# Altium schematic sheet JacdacTBlockButton 62.SchDoc: Complete design
size A4; DocumentNumber: 1; SheetNumber: 1; SheetTotal: 1; VersionControl_RevNumber: 1
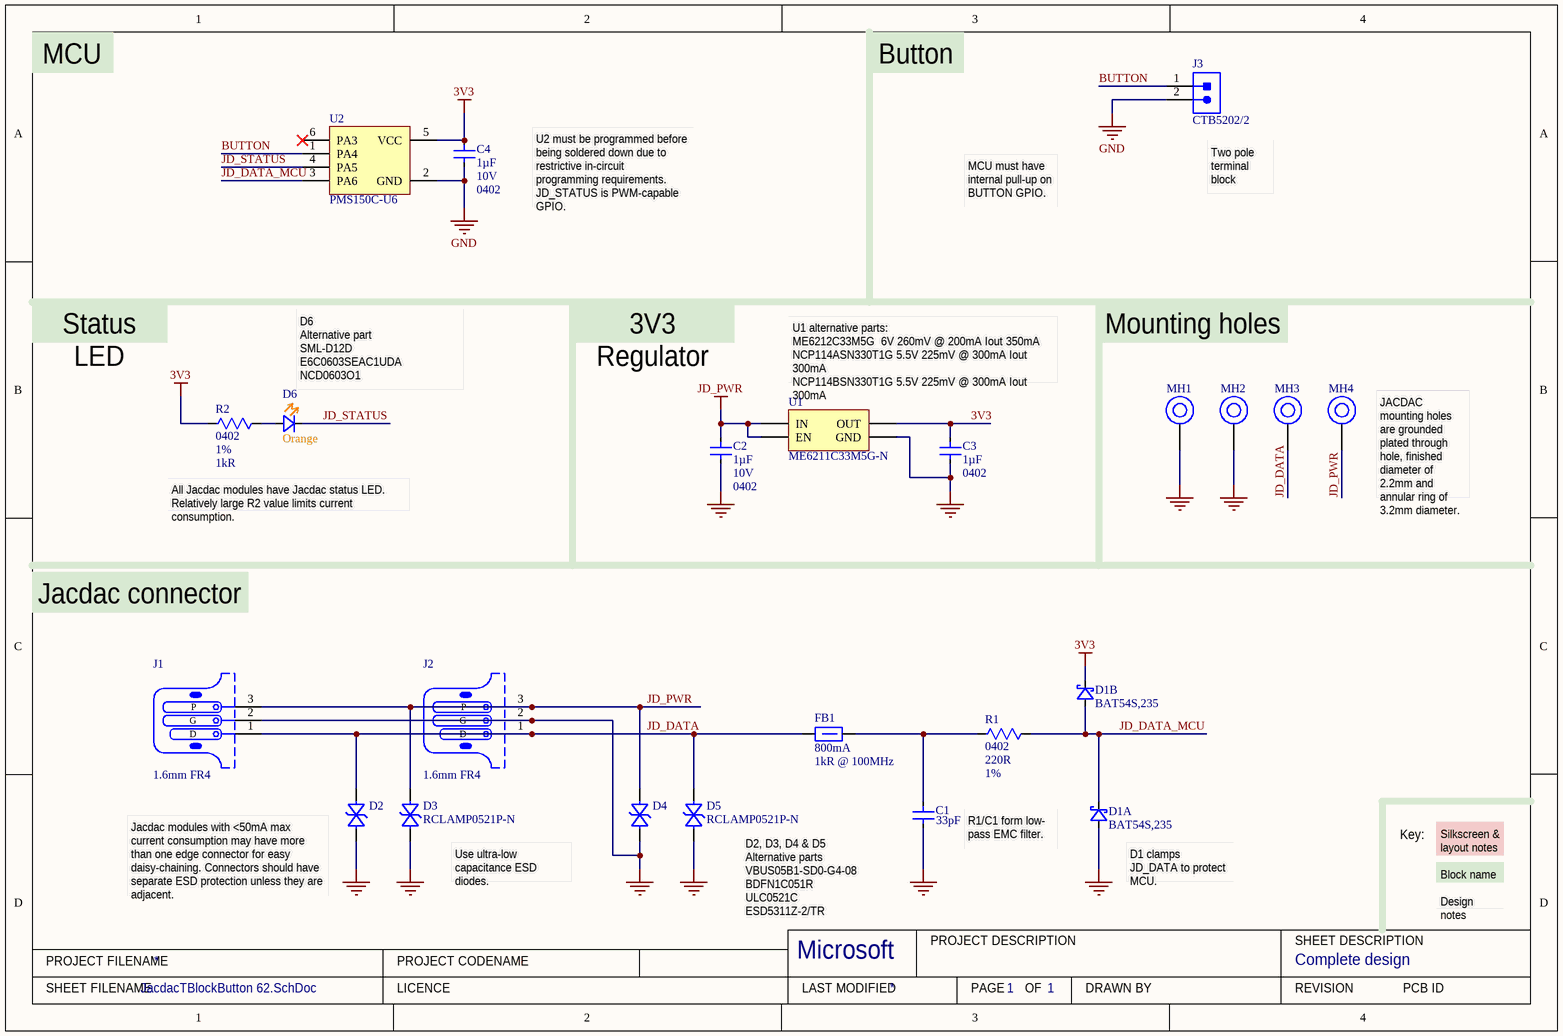
[diagram p0: JacdacTBlockButton 62.SchDoc]

## Parts
C1  Capacitance: 33pF  [C0402_0.55MM - without outline]  (hidden comment: CL05C330JB5NNNC)
C2  Capacitance: 1µF  Voltage Rating: 10V  Case Code (Imperial): 0402  [C0402_0.55MM - without outline]  (hidden comment: CL05A105KP5NNNC)
C3  Capacitance: 1µF  Case Code (Imperial): 0402  [C0402_0.55MM - without outline]  (hidden comment: CL05A105KP5NNNC)
C4  Capacitance: 1µF  Voltage Rating: 10V  Case Code (Imperial): 0402  [C0402_0.55MM - without outline]  (hidden comment: CL05A105KP5NNNC)
D1  Manufacturer Part Number: BAT54S,235  [NXP-BAT54S-TO-236AB - without outline]  (hidden comment: BAT54S)  (parts A,B of 2)
D2  RCLAMP0521P-N  [TVS 0402 - L]  (value not drawn)
D3  RCLAMP0521P-N  [TVS 0402 - L]
D4  RCLAMP0521P-N  [TVS 0402 - L]  (value not drawn)
D5  RCLAMP0521P-N  [TVS 0402 - L]
D6  Colour: Orange  [0603 Orange - without outline]  (hidden comment: 19-217/S2C-AQ1R1B/3T)
FB1  Current Rating: 800mA  Impedance: 1kR @ 100MHz  [TDK MPZ1608 0.8mm - without outline]  (hidden comment: TDK MPZ1608S102ATA00)
J1  PCB Type: 1.6mm FR4  [JACDAC_EDGE_CONNECTOR_NO_TRACES]  (hidden comment: 3 pin JACDAC edge connector)  (no BOM)
J2  PCB Type: 1.6mm FR4  [JACDAC_EDGE_CONNECTOR_NO_TRACES]  (hidden comment: 3 pin JACDAC edge connector)  (no BOM)
J3  TERMINAL BLOCK, WIRE TO BRD, 2POS  [CTB5202-2]  (value not drawn)
MH1  MH_5.0MMK_3.0MMC_2.1MMD_PTH  [MH_5.0MMK_3.0MMC_2.1MMD_PTH]  (value not drawn)  (no BOM)
MH2  MH_5.0MMK_3.0MMC_2.1MMD_PTH  [MH_5.0MMK_3.0MMC_2.1MMD_PTH]  (value not drawn)  (no BOM)
MH3  MH_5.0MMK_3.0MMC_2.1MMD_PTH  [MH_5.0MMK_3.0MMC_2.1MMD_PTH]  (value not drawn)  (no BOM)
MH4  MH_5.0MMK_3.0MMC_2.1MMD_PTH  [MH_5.0MMK_3.0MMC_2.1MMD_PTH]  (value not drawn)  (no BOM)
R1  Case Code (Imperial): 0402  Resistance: 220R  Tolerance: 1%  [R0402 - Without outline]  (hidden comment: RC0402FR-07220RL)
R2  Case Code (Imperial): 0402  Tolerance: 1%  Resistance: 1kR  [R0402 - Without outline]  (hidden comment: RC0402FR-071KL)
U1  ME6211C33M5G-N  [MICRONE-SOT23-5]
U2  Manufacturer Part Number: PMS150C-U6  [SOT23-6]  (hidden comment: PMS150C)

## Nets
3V3: C3.2 C4.2 D1.2(K) R2.2 U1.5(OUT) U2.5(VCC)
GND: C1.1 C2.1 C3.1 C4.1 D1.1(A) D2.2(A) D3.2(A) D4.2(A) D5.2(A) J1.2(G) J2.2(G) J3.2 MH1.1 MH2.1 U1.2(GND) U2.2(GND)
JD_PWR: C2.2 D3.1(K) D4.1(K) J1.3(P) J2.3(P) MH4.1 U1.1(IN) U1.3(EN)
BUTTON: J3.1 U2.1(PA4)
JD_DATA: D2.1(K) D5.1(K) FB1.1 J1.1(D) J2.1(D) MH3.1
JD_DATA_MCU: D1.3(K) R1.1 U2.3(PA6)
JD_STATUS: D6.1(K) U2.4(PA5)
NetC1_2: C1.2 FB1.2 R1.2
NetD6_2: D6.2(A) R2.1

Not connected (* = marked no-connect by the designer): U2 6(PA3)*

## Notes on the sheet
- MCU
- Button
- U2 must be programmed before being soldered down due to restrictive in-circuit programming requirements. JD_STATUS is PWM-capable GPIO.
- MCU must have internal pull-up on BUTTON GPIO.
- (near J3) Two pole terminal block
- Status LED
- (near D6) D6
  Alternative part
  SML-D12D
  E6C0603SEAC1UDA
  NCD0603O1
- 3V3 Regulator
- U1 alternative parts:
  ME6212C33M5G  6V 260mV @ 200mA Iout 350mA
  NCP114ASN330T1G 5.5V 225mV @ 300mA Iout 300mA
  NCP114BSN330T1G 5.5V 225mV @ 300mA Iout 300mA
- Mounting holes
- All Jacdac modules have Jacdac status LED. Relatively large R2 value limits current consumption.
- (near MH4) JACDAC mounting holes are grounded plated through hole, finished diameter of 2.2mm and annular ring of 3.2mm diameter.
- Jacdac connector
- R1/C1 form low-
  pass EMC filter.
- Key:
- Silkscreen & layout notes
- (near D2) Jacdac modules with <50mA max current consumption may have more than one edge connector for easy daisy-chaining. Connectors should have separate ESD protection unless they are adjacent.
- (near D3) Use ultra-low capacitance ESD diodes.
- (near C1) D2, D3, D4 & D5
  Alternative parts
  VBUS05B1-SD0-G4-08
  BDFN1C051R
  ULC0521C
  ESD5311Z-2/TR
- (near D1) D1 clamps JD_DATA to protect MCU.
- Block name
- Design notes
- PROJECT FILENAME
- PROJECT CODENAME
- Microsoft
- PROJECT DESCRIPTION
- SHEET DESCRIPTION
- SHEET FILENAME
- LICENCE
- LAST MODIFIED
- PAGE
- OF
- DRAWN BY
- REVISION
- PCB ID

## Library data of the parts
C1 = CL05C330JB5NNNC: CAP CER 33PF 50V C0G/NP0 0402; Manufacturer: Samsung; Material: Ceramic; Tolerance: 5%; Dielectric: C0G; Temperature Coefficient: 300ppm/°C; Supplier 1: Digi-Key; Manufacturer Part Number: CL05C330JB5NNNC; RoHS: Yes; Category: Ceramic Capacitors; Stock 1: 5436088; Pricing 1: 1=0.10000, 10=0.02300, 50=0.01260, 100=0.01040, 500=0.00740, 1000=0.00582, 2500=0.00529, 5000=0.00487 (USD); Mount: Surface Mount; Case Code (Metric): 1005; Case Code (Imperial): 0402; Contact Plating: Tin; Min Operating Temperature: -55°C; Max Operating Temperature: 125°C; Package Quantity: 1; Packaging: Tape and Reel; Voltage: 50V; Voltage Rating (DC): 50V; Series: CL; Construction: Flat; Length: 1mm; Width: 0.02inch; Height: 0.5mm; Thickness: 0.022inch; Depth: 0.5mm; Radiation Hardening: No; Lead Free: Lead Free; RoHS Compliant: Yes; ComponentLink1URL: https://datasheet.ciiva.com/15195/getdatasheetpartid-355282-15195687.pdf; ComponentLink1Description: Online datasheet; Supplier 2: Newark; Stock 2: 45340; Pricing 2: 1=0.12500, 25=0.02900, 100=0.01300, 250=0.01100, 500=0.00900, 1000=0.00600 (USD); Supplier 3: Mouser; Stock 3: 8877; Pricing 3: 1=0.10000, 10=0.01400, 50=0.01400, 100=0.01100, 1000=0.00600, 10000=0.00400 (USD); Supplier 4: Farnell; Stock 4: 10934; Pricing 4: 150=0.01120, 500=0.00860, 2500=0.00640, 5000=0.00550 (GBP); Supplier Part Number 4: 3013373RL; Supplier Part Number 3: 187-CL05C330JB5NNNC; Supplier Part Number 2: 82AC9259; Supplier Part Number 1: 1276-1272-1-ND; Voltage Rating: 50V; Case/Package: 0402
C2-C4 = CL05A105KP5NNNC: CAP CER 1UF 10V X5R 0402; Manufacturer: Samsung; Material: Ceramic; Tolerance: 10%; Supplier 1: Digi-Key; Manufacturer Part Number: CL05A105KP5NNNC; RoHS: Yes; Category: Capacitors; Stock 1: 5705569; Pricing 1: 1=0.10000, 10=0.03900, 50=0.02100, 100=0.01720, 500=0.01228, 1000=0.00965, 2500=0.00877, 5000=0.00807 (USD); Mount: Surface Mount; Case/Package: 0402; Case Code (Metric): 1005; Contact Plating: Tin; Min Operating Temperature: -55°C; Max Operating Temperature: 85°C; Dielectric: X5R; Package Quantity: 1; Packaging: Tape and Reel; Length: 1mm; Height: 0.5mm; Width: 0.02inch; Thickness: 0.022inch; Depth: 0.5mm; Radiation Hardening: No; ComponentLink1URL: https://datasheet.ciiva.com/15195/getdatasheetpartid-358390-15195630.pdf; ComponentLink1Description: Online datasheet; Supplier 2: Mouser; Stock 2: 928941; Pricing 2: 1=0.10000, 10=0.04200, 100=0.01800, 500=0.01300, 1000=0.01000, 2500=0.00900 (USD); Supplier 3: Farnell; Stock 3: 53670; Pricing 3: 10=0.02450, 100=0.02000, 500=0.01310, 2500=0.00920, 5000=0.00810, 10000=0.00640, 50000=0.00490 (GBP); Supplier Part Number 3: 3013329; Supplier Part Number 2: 187-CL05A105KP5NNNC; Supplier Part Number 1: 1276-1076-1-ND; Created: DG; Checked: ?
  C3: Voltage Rating: 10V
D1 = BAT54S: DIODE ARRAY SCHOTTKY 30V SOT23; Manufacturer: Nexperia; Supplier 1: Digi-Key; RoHS: No; Category: Rectifier Diodes; Stock 1: 14011; Pricing 1: 1=0.13000, 10=0.11900, 100=0.05610, 500=0.03326, 1000=0.02185, 5000=0.02138 (USD); ComponentLink1URL: https://assets.nexperia.com/documents/data-sheet/BAT54_SER.pdf; ComponentLink1Description: NXP datasheet online; Supplier 2: Mouser; Supplier 3: RSComponents; Supplier Part Number 2: 771-BAT54S235; Supplier Part Number 3: 1707990; Supplier Part Number 1: 1727-1868-1-ND
D2-D5 = RCLAMP0521P-N: Bidirectional 5V (Max) 6V 16V 3.5A (8/20us) 0402 TVS RoHS; Manufacturer: Born Semiconductor; Package: 0402; Created By: D Gakure; Checked By: ?; Supplier1: LCSC; Supplier1 Part Number: C316043; ComponentLink1Description: Online datasheet; ComponentLink1URL: https://datasheet.lcsc.com/szlcsc/Bourne-Semicon-Shenzhen-RCLAMP0521P-N_C316043.pdf; Manufacturer Part Number: RCLAMP0521P-N
D6 = 19-217/S2C-AQ1R1B/3T: LED ORANGE DIFFUSED 1608 SMD; Manufacturer: Everlight Elec; Lens Color: White; Luminous Intensity: 100mcd; Test Current: 25mA; Dominant Wavelength: 605nm; Forward Voltage: 2.05V; Manufacturer Part Number: 19-217/S2C-AQ1R1B/3T; RoHS: Yes; Category: LEDs; Mount: Surface Mount; Case/Package: 0603; Color: Orange; Case Code (Metric): 1608; Case Code (Imperial): 0603; Lens Transparency: Diffused; Length: 1.6mm; Width: 0.8mm; Height: 0.65mm; Lead Free: Lead Free; ComponentLink1URL: https://datasheet.lcsc.com/lcsc/1912171731_Everlight-Elec-19-217-S2C-AQ1R1B-3T_C146215.pdf; ComponentLink1Description: Online datasheet; Supplier 1: LCSC; Supplier 1 Part Number: C146215
FB1 = TDK MPZ1608S102ATA00: 0603 1k@100MHz 0.8A chip; Core Material: Ferrite; Tolerance: 25%; DC Resistance (DCR): 300mR; Supplier 1: Digi-Key; Stock 1: 113542; Pricing 1: 1=0.1, 10=0.079, 25=0.0716, 50=0.0644, 100=0.0472, 250=0.03432, 500=0.03146, 1000=0.02717 (USD); Mount: Surface Mount; Case/Package: 0603; Case Code (Metric): 1608; Case Code (Imperial): 0603; Package Quantity: 4000; Packaging: Tape and Reel; Max DC Current: 800mA; Length: 0.063inch; Height: 0.037inch; Width: 0.031inch; ComponentLink2URL: https://www.mouser.co.uk/datasheet/2/400/eads_commercial_power_mpz1608_en-923650.pdf; ComponentLink2Description: datasheet online; Supplier 2: Mouser; ComponentLink3Description: datasheet; ComponentLink3URL: Y:\System\Altium\Libraries 2014\TDK\Datasheets\eads_commercial_power_mpz1608_en-923650.pdf; Supplier Part Number 1: 445-8694-1-ND; Supplier Part Number 2: 810-MPZ1608S102ATA00; Manufacturer: TDK; Manufacturer Part Number: MPZ1608S102ATA00
J1 J2 = Jacdac edge connector: 3 pin Jacdac edge connector 1.27mm pitch; Manufacturer Part Number: JACDAC_EDGE_CONNECTOR; Checked By: ?; Created By: D. Gakure; ComponentLink1Description: Yuliang JACDAC cable connector drawing online; ComponentLink1URL: https://github.com/microsoft/jacdac-mdk/blob/main/connector/JACDAC-Connector-by-Yuliang-2020-11-28.pdf; ComponentLink2Description: JACDAC PCB edge connector spec onlin; ComponentLink2URL: https://github.com/microsoft/jacdac-mdk/blob/main/connector/JACDAC_PCB_Edge_Connector_Drawing_JD-PEC-01_rev_01.pdf
J3 = CTB5202/2: CAMDENBOSS - CTB5202/2 - TERMINAL BLOCK, WIRE TO BRD, 2POS; Manufacturer: Camden Electronics Boss; Connector Type: PCB,Terminal Block; Number of Positions: 2; Supplier 1: Farnell; RoHS: Yes; Category: Terminal Blocks; Stock 1: 17395; Pricing 1: 100=0.23200, 500=0.16600, 1000=0.13600, 2500=0.11600, 5000=0.10300, 10000=0.09270 (GBP); Mount: Standard; Contact Plating: Nickel; Contact Material: Brass; Number of Contacts: 2; REACH SVHC: No SVHC; RoHS Compliant: No; ComponentLink1URL: https://www.farnell.com/datasheets/2866649.pdf; ComponentLink1Description: Datasheet (online); Supplier 2: Newark; Supplier Part Number 1: 1717001; Supplier Part Number 2: 24R5905; Manufacturer Part Number: CTB5202/2
MH1-MH4 = MH_5.0MMK_3.0MMC_2.1MMD_PTH: Mounting Hole 5.0mm keepout, 3.0mm annualar ring and 2.1mm Drill PTH
R1 = RC0402FR-07220RL: RES SMD 220 OHM 1% 1/16W 0402; Manufacturer: Yageo; Power Rating: 62.5mW; Voltage Rating: 50V; Temperature Coefficient: 100ppm/°C; Max Power Dissipation: 63mW; Supplier 1: Digi-Key; Manufacturer Part Number: RC0402FR-07220RL; RoHS: Yes; Category: Resistors; Stock 1: 1286042; Pricing 1: 1=0.10000, 10=0.01400, 100=0.00580, 1000=0.00262, 2500=0.00228, 5000=0.00188 (USD); Case/Package: 0402; Number of Pins: 2; Case Code (Metric): 1005; Min Operating Temperature: -55°C; Max Operating Temperature: 155°C; Packaging: Tape and Reel; Voltage Rating (DC): 50V; Package Quantity: 1; Termination: SMD/SMT; Resistor Type: Thick Film; Number of Terminations: 2; Features: Moisture Resistant; Length: 1mm; Height: 0.016inch; Width: 0.02inch; Depth: 0.5mm; REACH SVHC: No SVHC; Military Standard: Not; Lead Free: Lead Free; ComponentLink1URL: https://datasheet.ciiva.com/11819/0900766b80c66297-11819466.pdf; ComponentLink1Description: Online datasheet; Supplier 2: Mouser; Stock 2: 324625; Pricing 2: 1=0.10000, 10=0.01200, 100=0.00400, 1000=0.00400, 2500=0.00400, 10000=0.00300 (USD); Supplier 3: Farnell; Stock 3: 18234; Pricing 3: 1=0.08130, 25=0.01210, 100=0.01120, 250=0.01030, 500=0.00900 (GBP); Supplier Part Number 3: 2147864; Supplier Part Number 2: 603-RC0402FR-07220RL; Supplier Part Number 1: 311-220LRCT-ND; Created: D.G; Checked: ?
R2 = RC0402FR-071KL: RES SMD 1K OHM 1% 1/16W 0402; Manufacturer: Yageo; Temperature Coefficient: 100ppm/°C; Voltage Rating (DC): 50V; Power Rating: 62.5mW; Supplier 1: Digi-Key; Manufacturer Part Number: RC0402FR-071KL; RoHS: Yes; Category: Resistors; Stock 1: 37591306; Pricing 1: 1=0.10000, 10=0.01400, 100=0.00580, 1000=0.00262, 2500=0.00228, 5000=0.00188 (USD); Case/Package: 0402; Number of Pins: 2; Case Code (Metric): 1005; Min Operating Temperature: -55°C; Max Operating Temperature: 155°C; Resistor Type: Thick Film; Packaging: Tape and Reel; Voltage Rating: 50V; Termination: SMD/SMT; Length: 1mm; Height: 0.32mm; Width: 0.5mm; Depth: 0.5mm; REACH SVHC: Unknown; Lead Free: Lead Free; Military Standard: Not; ComponentLink2URL: https://datasheet.ciiva.com/12666/pyu-rc0402-51-rohs-l-6-r-12666741.pdf; ComponentLink2Description: Online datasheet; Supplier 2: Mouser; Stock 2: 11912978; Pricing 2: 1=0.10000, 10=0.01200, 100=0.00400, 1000=0.00400, 2500=0.00400, 10000=0.00300 (USD); Supplier 3: Farnell; Stock 3: 29900; Pricing 3: 1=0.08130, 25=0.01210, 100=0.01120, 250=0.01030, 500=0.00900 (GBP); Supplier Part Number 3: 2132441; Supplier Part Number 2: 603-RC0402FR-071KL; Supplier Part Number 1: 311-1.00KLRDKR-ND; Created: D.G; Checked: ?
U1 = ME6211C33M5G-N: 6V 260mV @ 200mA(typ) - - Fixed 3.3V SOT-23-5 Linear Voltage Regulators (LDO) ROHS; manufacturer: MICRONE(Nanjing Micro One Elec); Output Current: 500mA; Output Configuration: Positive; Number of Regulators: 1; Max Input Voltage: 6; Dropout Voltage: 200mV; Supplier Part Number: C82942; Category: Voltage Regulators - Linear; Stock 1: 32529; Pricing 1: 1=0.33000, 10=0.24900, 25=0.21760, 100=0.12440, 250=0.11664, 500=0.09330, 1000=0.07153 (USD); Mount: Surface Mount; Case/Package: SOT-23-5; Supplier 1: LCSC; Output Type: Fixed; Min Output Voltage: 3.3V; ComponentLink3URL: https://datasheet.lcsc.com/lcsc/1811131510_MICRONE-Nanjing-Micro-One-Elec-ME6211C33M5G-N_C82942.pdf; ComponentLink3Description: On Semi datasheet online; Created: DG; Checked: ?; Manufacturer Part Number: ME6211C33M5G-N
U2 = PMS150C: 8bit OTP Type IO Controller; Manufacturer: PADAUK; ComponentLink1Description: Padauk datasheet online; ComponentLink1URL: http://www.padauk.com.tw/upload/doc/PMS15A,PMS150C%20datasheet%20V108_EN_20200724.pdf; Supplier 1: LCSC; Supplier Part Number 1: C168658; Package: SOT-23-6; Pricing 1: 1=0.6, 10=0.0595, 100=0.0449; Stock 1: 0; Supplier Order Qty 1: 3000